# EAGLE design DB9 - USB (EAGLE 5.08)
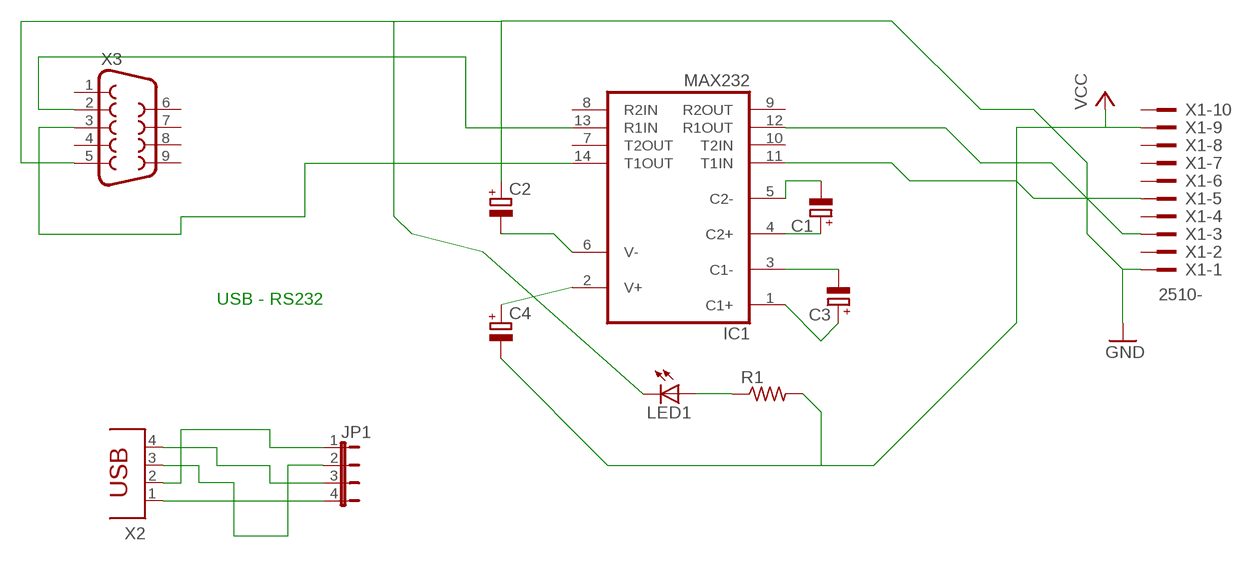
[diagram p0: schematic, sheet 1]

## Parts
C1  CPOL-EUE5-5  [E5-5]
C2  CPOL-EUE5-5  [E5-5]
C3  CPOL-EUE5-5  [E5-5]
C4  CPOL-EUE5-5  [E5-5]
IC1  MAX232  [DIL16]
JP1  JP4E  [JP4]
LED1  LED3MM  [LED3MM]
R1  R-US_0204/7  [0204/7]
X1  2510-  [PAK100/2500-10]
X2  PN61729  [PN61729]
X3  F09H  [F09H]

## Nets
GND: C2.+ LED1.K(C) X1.1 X3.5
N$1: JP1.4 X2.1
N$2: JP1.3 X2.4
N$3: JP1.2 X2.3
N$4: JP1.1 X2.2
N$5: C3.+ IC1.1(C1+)
N$6: C3.- IC1.3(C1-)
N$7: C1.+ IC1.4(C2+)
N$8: C1.- IC1.5(C2-)
N$9: C4.+ IC1.2(V+)
N$10: C2.- IC1.6(V-)
N$14: IC1.13(R1IN) X3.2
N$15: IC1.14(T1OUT) X3.3
N$16: LED1.A R1.1
N$18: IC1.12(R1OUT) X1.3
N$19: IC1.11(T1IN) X1.5
VCC: C4.- R1.2 X1.9
Unconnected: IC1.7(T2OUT) IC1.8(R2IN) IC1.9(R2OUT) IC1.10(T2IN) X1.2 X1.4 X1.6 X1.7 X1.8 X1.10 X3.1 X3.4 X3.6 X3.7 X3.8 X3.9

## Notes on the sheet
- USB - RS232

## Power pins joined to a net without a drawn wire
GND: IC1.15(GND)
VCC: IC1.16(VCC)

## Library data of the parts
C1-C4 = rcl:CPOL-EU: POLARIZED CAPACITOR, European symbol
IC1 = maxim:MAX232: RS232 TRANSEIVER
JP1 = jumper:JP4E: JUMPER
LED1 = led:LED: LED OSRAM: - CHIPLED LG R971, LG N971, LY N971, LG Q971, LY Q971, LO R971, LY R971 LH N974, LH R974 LS Q976, LO Q976, LY Q976 LO Q996 - Hyper CHIPLED LW Q18S LB Q993, LB Q99A, LB R99A - SideLED LS A670, LO A670, LY A670, LG A670, LP A670 LB A673, LV A673, LT A673, LW A673 LH A674 LY A675 LS A676, LA A676, LO A676, LY A676, LW A676 LS A679, LY A679, LG A679 - Hyper Micro SIDELED® LS Y876, LA Y876, LO Y876, LY Y876 LT Y87S - SmartLED LW L88C, LW L88S LB L89C, LB L89S, LG L890 LS L89K, LO L89K, LY L89K LS L896, LA L896, LO L896, LY L896 - TOPLED LS T670, LO T670, LY T670, LG T670, LP T670 LSG T670, LSP T670, LSY T670, LOP T670, LYG T670 LG T671, LOG T671, LSG T671 LB T673, LV T673, LT T673, LW T673 LH T674 LS T676, LA T676, LO T676, LY T676, LB T676, LH T676, LSB T676, LW T676 LB T67C, LV T67C, LT T67C, LS T67K, LO T67K, LY T67K, LW E67C LS E67B, LA E67B, LO E67B, LY E67B, LB E67C, LV E67C, LT E67C LW T67C LS T679, LY T679, LG T679 LS T770, LO T770, LY T770, LG T770, LP T770 LB T773, LV T773, LT T773, LW T773 LH T774 LS E675, LA E675, LY E675, LS T675 LS T776, LA T776, LO T776, LY T776, LB T776 LHGB T686 LT T68C, LB T68C - Hyper Mini TOPLED® LB M676 - Mini TOPLED Santana® LG M470 LS M47K, LO M47K, LY M47K Source: http://www.osram.convergy.de LUXEON: - LUMILED® LXK2-PW12-R00, LXK2-PW12-S00, LXK2-PW14-U00, LXK2-PW14-V00 LXK2-PM12-R00, LXK2-PM12-S00, LXK2-PM14-U00 LXK2-PE12-Q00, LXK2-PE12-R00, LXK2-PE12-S00, LXK2-PE14-T00, LXK2-PE14-U00 LXK2-PB12-K00, LXK2-PB12-L00, LXK2-PB12-M00, LXK2-PB14-N00, LXK2-PB14-P00, LXK2-PB14-Q00 LXK2-PR12-L00, LXK2-PR12-M00, LXK2-PR14-Q00, LXK2-PR14-R00 LXK2-PD12-Q00, LXK2-PD12-R00, LXK2-PD12-S00 LXK2-PH12-R00, LXK2-PH12-S00 LXK2-PL12-P00, LXK2-PL12-Q00, LXK2-PL12-R00 Source: www.luxeon.com KINGBRIGHT: KA-3528ASYC Source: www.kingbright.com
R1 = resistor:R-US_: RESISTOR, American symbol
X1 = con-3m:2510-: 3M (TM) Pak 100 4-Wall Header Source: 3M
X2 = con-berg:PN61729: BERG USB connector
X3 = con-subd:F09: SUB-D

## Board
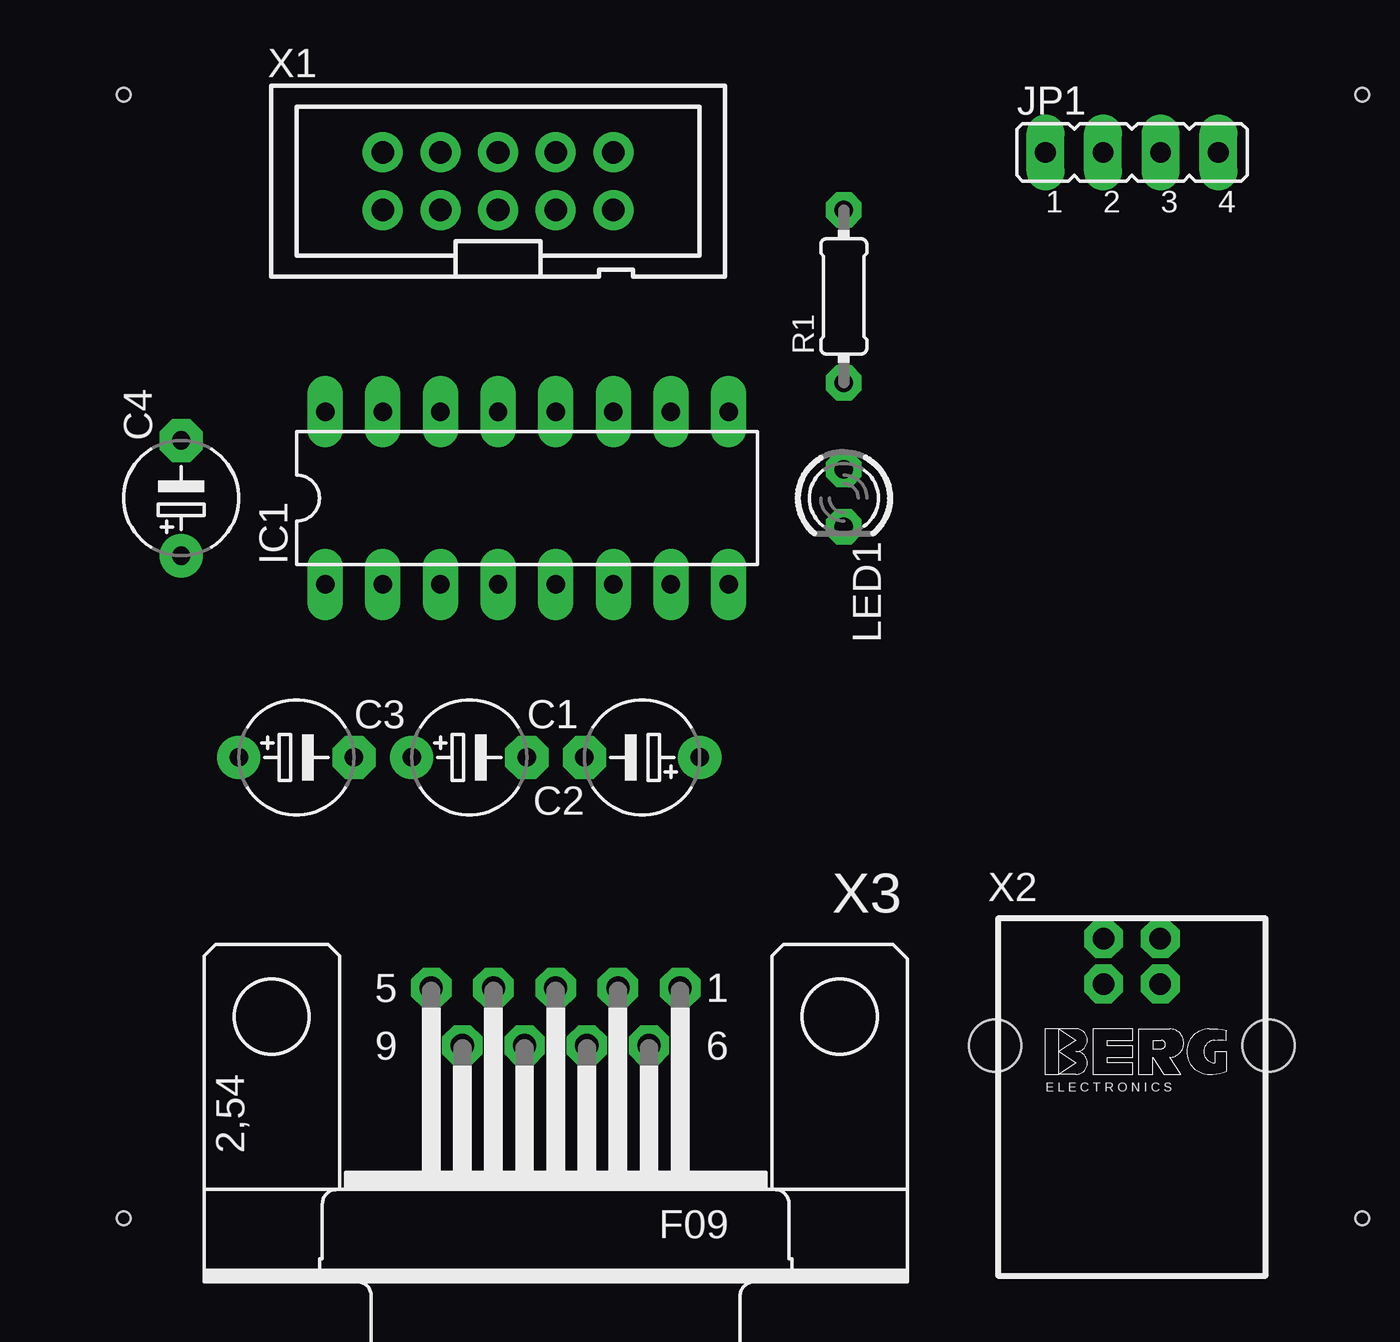
[diagram p1: board, top side]
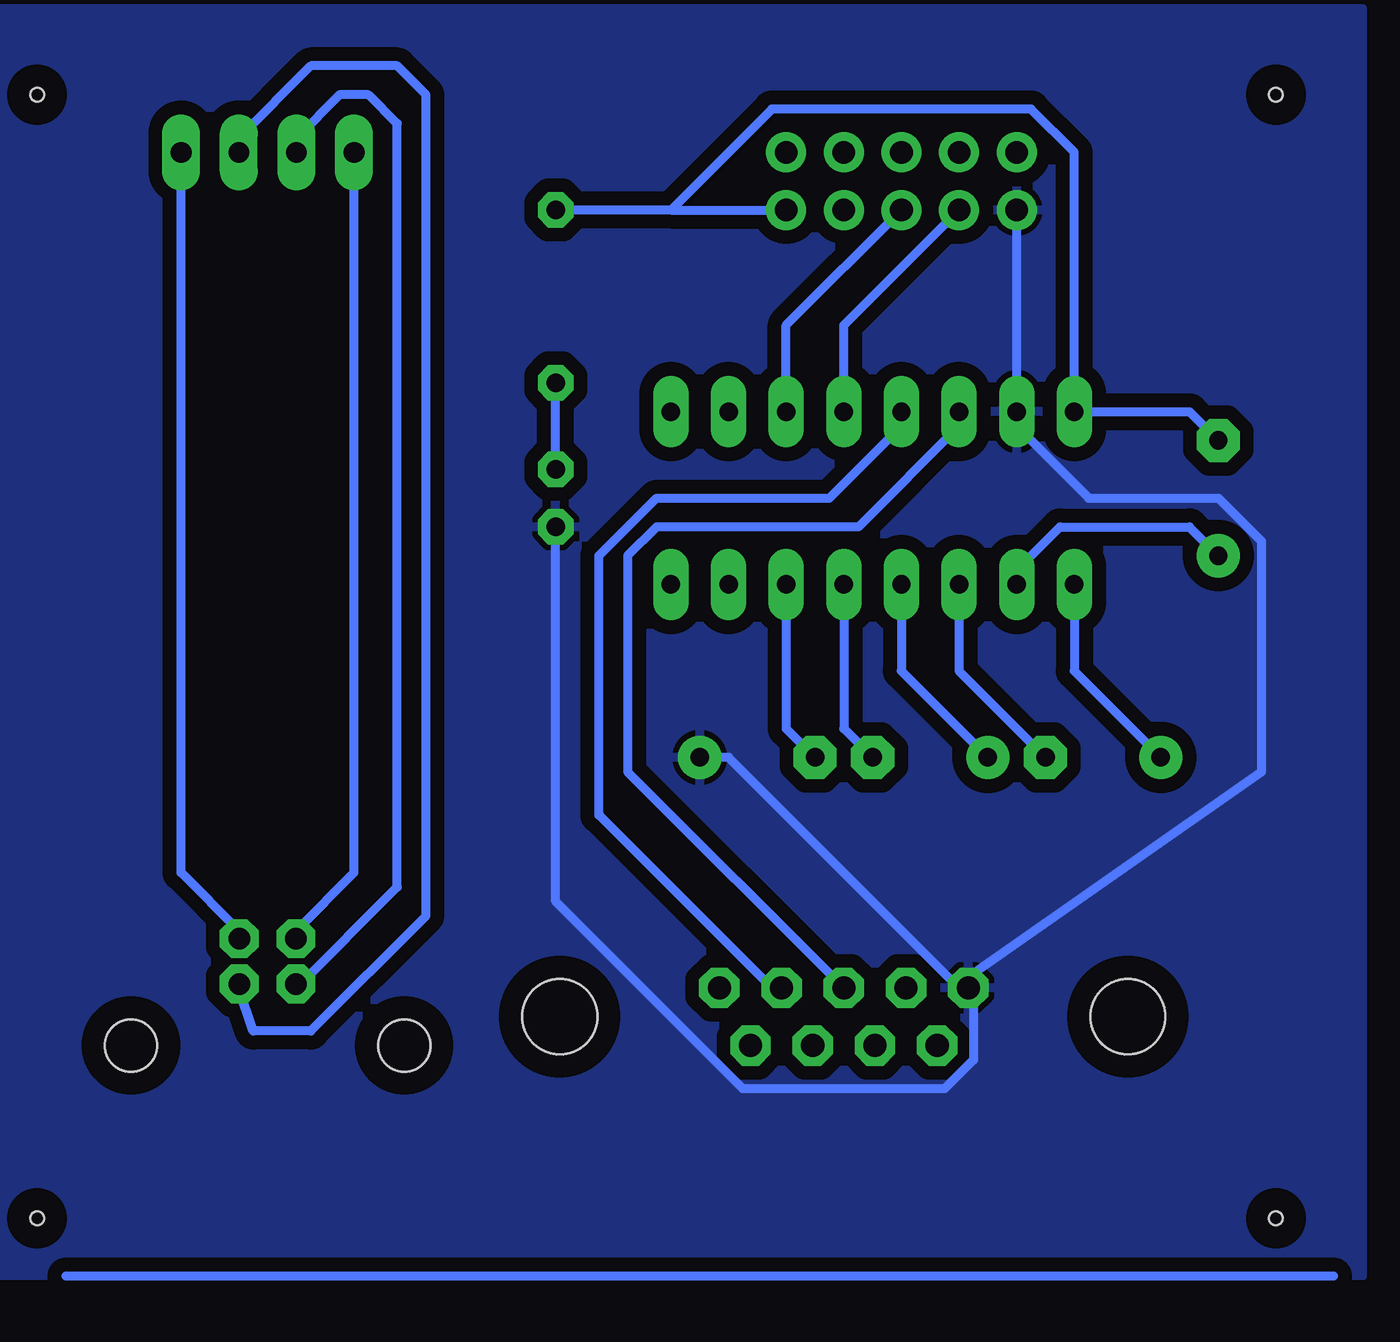
[diagram p2: board, bottom side, seen from below]

No outline drawn. Coordinates in mm, seen from the top.
Copper layers (1*16): Top 0.035mm / dielectric 1.5mm / Bottom 0.035mm
Design rules "PCB 24mil *": minimum track width 16mil, minimum drill 24mil, track to track 24mil, track to pad 24mil, pad to pad 18mil, via to via 18mil, smd to smd 8mil, copper to edge 40mil, drill to drill 8mil, minimum pad ring 15mil, minimum via ring 8mil, stop-mask expansion 4mil, vias tented up to drill 0mil, thermal gap 10mil
Holes 0.6 mm at -50.8,53.34 -50.8,3.81 3.81,53.34 3.81,3.81

### Footprints (pad centres in the part's own frame; a part is rotated, then mirrored left to right if it is on the bottom)
E5-5 = drill 0.813 pad 1.905 round: + -2.54,0 | drill 0.813 pad 1.905 octagon: - 2.54,0
DIL16 = drill 0.813 long: 1 -8.89,-3.81; 2 -6.35,-3.81; 3 -3.81,-3.81; 4 -1.27,-3.81; 5 1.27,-3.81; 6 3.81,-3.81; 7 6.35,-3.81; 8 8.89,-3.81; 9 8.89,3.81; 10 6.35,3.81; 11 3.81,3.81; 12 1.27,3.81; 13 -1.27,3.81; 14 -3.81,3.81; 15 -6.35,3.81; 16 -8.89,3.81
JP4 = drill 0.914 long: 1 -3.81,0; 2 -1.27,0; 3 1.27,0; 4 3.81,0
LED3MM = drill 0.813 octagon: A -1.27,0; K 1.27,0
0204/7 = drill 0.813 octagon: 1 -3.81,0; 2 3.81,0
PAK100/2500-10 = drill 1 pad 1.422 round: 1 -5.08,-1.27; 2 -5.08,1.27; 3 -2.54,-1.27; 4 -2.54,1.27; 5 0,-1.27; 6 0,1.27; 7 2.54,-1.27; 8 2.54,1.27; 9 5.08,-1.27; 10 5.08,1.27
PN61729 = drill 0.95 octagon: 1 1.25,4.71; 2 -1.25,4.71; 3 -1.25,2.71; 4 1.25,2.71 | hole 2.3: -6.02,0; 6.02,0
F09H = drill 1.016 octagon: 1 -5.486,-1.27; 2 -2.743,-1.27; 3 0,-1.27; 4 2.743,-1.27; 5 5.486,-1.27; 6 -4.115,1.27; 7 -1.372,1.27; 8 1.372,1.27; 9 4.115,1.27 | hole 3.302: -12.522,0; 12.522,0

### Placement (x,y rotation side)
C1  -35.56,24.13 0 top
C2  -27.94,24.13 180 top
C3  -43.18,24.13 0 top
C4  -48.26,35.56 90 top
IC1  -33.02,35.56 0 top
JP1  -6.35,50.8 0 top
LED1  -19.05,35.56 270 top
R1  -19.05,44.45 90 top
X1  -34.29,49.53 0 top
X2  -6.35,11.43 0 top
X3  -31.75,12.7 180 top

### Tracks (layer width: path | path; a pad name or v marks a point on that pad's centre or on a via)
GND
  Bottom 0.406: X1.1 IC1.15 -39.37,38.73 -42.55,35.56 -48.26,35.56 -50.16,33.66 -50.16,23.5 -37.47,14.61 | LED1.K -19.05,17.78 -27.3,9.53 -36.2,9.53 -37.47,10.79 -37.47,13.97 | -37.47,14.61 -37.47,13.97 | -37.47,13.97 X3.5 | C2.+ -26.67,24.13 -36.83,13.97 X3.5 | -37.47,14.61 X3.5
  pour Bottom: -53.34,1.27 7.62,1.27 7.62,57.15 -54.61,57.15 -54.61,1.27
N$1
  Bottom 0.406: JP1.4 -2.54,19.05 -5.08,16.51 X2.1
N$2
  Bottom 0.406: JP1.3 -5.08,51.44 -8.26,54.61 -12.06,54.61 -13.34,53.34 -13.34,17.14 -8.26,12.06 -5.71,12.06 -5.08,13.97 X2.4
N$3
  Bottom 0.406: JP1.2 -7.62,51.44 -9.53,53.34 -10.79,53.34 -12.06,52.07 -12.06,18.41 -7.62,13.97 X2.3
N$4
  Bottom 0.406: JP1.1 -10.16,19.05 -7.62,16.51 X2.2
N$5
  Bottom 0.406: IC1.1 -41.91,27.94 C3.+
N$6
  Bottom 0.406: IC1.3 -36.83,27.94 C3.-
N$7
  Bottom 0.406: IC1.4 -34.29,27.94 C1.+
N$8
  Bottom 0.406: IC1.5 -31.75,25.4 C1.-
N$9
  Bottom 0.406: IC1.2 -39.37,32.38 -41.27,34.29 -46.99,34.29 C4.+
N$10
  Bottom 0.406: IC1.6 -29.21,25.4 C2.-
N$12
  Bottom 0.406: 2.54,1.27 -53.34,1.27
N$14
  Bottom 0.406: IC1.13 -34.29,38.73 -31.11,35.56 -23.5,35.56 -20.95,33.02 -20.95,21.59 -28.57,13.97 X3.2
N$15
  Bottom 0.406: IC1.14 -36.83,38.73 -32.38,34.29 -23.5,34.29 -22.23,33.02 -22.23,23.5 X3.3
N$16
  Bottom 0.406: LED1.A R1.1
N$18
  Bottom 0.406: IC1.12 -31.75,43.18 X1.3
N$19
  Bottom 0.406: IC1.11 -29.21,43.18 X1.5
VCC
  Bottom 0.406: C4.- -46.99,39.37 IC1.16 -41.91,50.8 -40.01,52.7 -28.57,52.7 -24.13,48.26 | -24.13,48.26 X1.9 | -24.13,48.26 R1.2